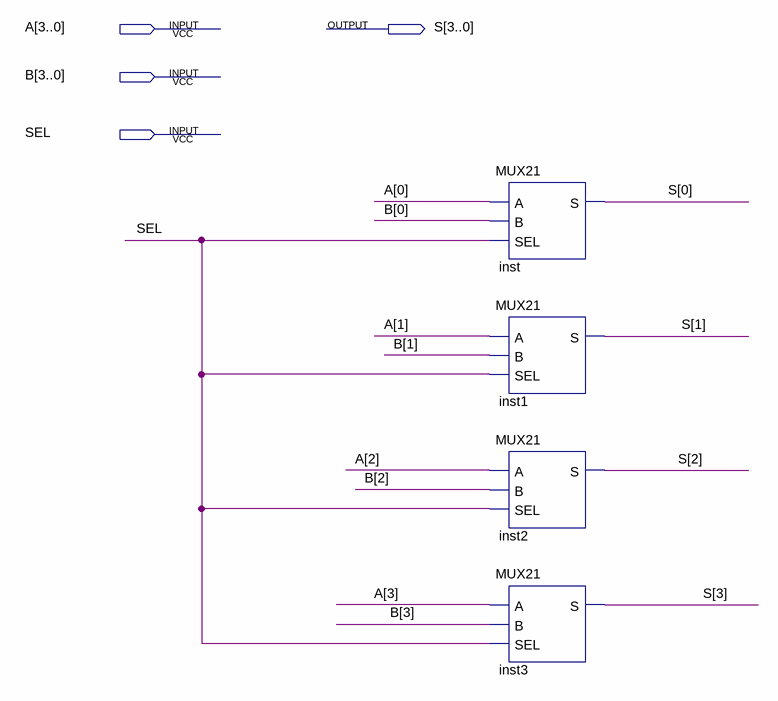
[diagram p0: schematic sheet]
// Quartus schematic MUX421.bdf as structural Verilog: 4 symbols, 4 pins
module MUX421 (
  input  [3:0] A,
  input  [3:0] B,
  input  SEL,
  output [3:0] S
);

  MUX21 inst (.A(A[0]), .B(B[0]), .SEL(SEL), .S(S[0]));
  MUX21 inst1 (.A(A[1]), .B(B[1]), .SEL(SEL), .S(S[1]));
  MUX21 inst2 (.A(A[2]), .B(B[2]), .SEL(SEL), .S(S[2]));
  MUX21 inst3 (.A(A[3]), .B(B[3]), .SEL(SEL), .S(S[3]));
endmodule
